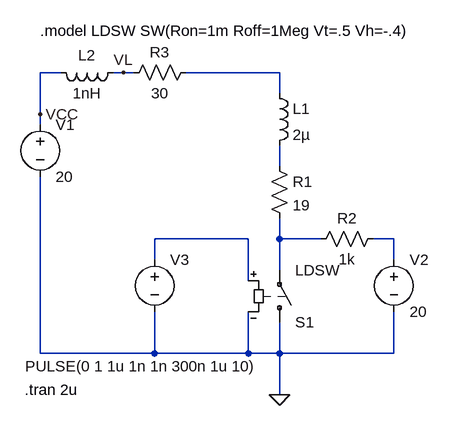
[diagram p0: schematic current_step_response_DEC.asc]
current_step_response_DEC.asc, the LTspice schematic file:
Version 4
SHEET 1 916 680
WIRE -176 80 -208 80
WIRE -80 80 -96 80
WIRE -64 80 -80 80
WIRE 160 80 16 80
WIRE 160 112 160 80
WIRE -208 144 -208 80
WIRE -208 160 -208 144
WIRE 160 224 160 192
WIRE 112 336 -32 336
WIRE 160 336 160 304
WIRE 224 336 160 336
WIRE 336 336 304 336
WIRE -32 368 -32 336
WIRE 336 368 336 336
WIRE 160 384 160 336
WIRE 112 400 112 336
WIRE -208 512 -208 240
WIRE -32 512 -32 448
WIRE -32 512 -208 512
WIRE 112 512 112 448
WIRE 112 512 -32 512
WIRE 160 512 160 464
WIRE 160 512 112 512
WIRE 336 512 336 448
WIRE 336 512 160 512
WIRE 160 576 160 512
FLAG 160 576 0
FLAG -208 144 VCC
FLAG -80 80 VL
SYMBOL ind 144 96 R0
SYMATTR InstName L1
SYMATTR Value 2µ
SYMBOL res 144 208 R0
SYMATTR InstName R1
SYMATTR Value 19
SYMBOL voltage -208 144 R0
SYMATTR InstName V1
SYMATTR Value 20
SYMBOL voltage 336 352 R0
SYMATTR InstName V2
SYMATTR Value 20
SYMBOL res 320 320 R90
WINDOW 0 0 56 VBottom 2
WINDOW 3 32 56 VTop 2
SYMATTR InstName R2
SYMATTR Value 1k
SYMBOL sw 160 480 M180
SYMATTR InstName S1
SYMATTR Value LDSW
SYMBOL voltage -32 352 R0
WINDOW 3 -199 180 Left 2
WINDOW 123 0 0 Left 0
WINDOW 39 0 0 Left 0
SYMATTR Value PULSE(0 1 1u 1n 1n 300n 1u 10)
SYMATTR InstName V3
SYMBOL res 32 64 R90
WINDOW 0 0 56 VBottom 2
WINDOW 3 32 56 VTop 2
SYMATTR InstName R3
SYMATTR Value 30
SYMBOL ind -80 64 R90
WINDOW 0 5 56 VBottom 2
WINDOW 3 32 56 VTop 2
SYMATTR InstName L2
SYMATTR Value 1nH
TEXT -208 16 Left 2 !.model LDSW SW(Ron=1m Roff=1Meg Vt=.5 Vh=-.4)
TEXT -232 568 Left 2 !.tran 2u

The netlist it stands for:
* current_step_response_DEC.asc
L1 N001 N002 2µ
R1 N002 N004 19
V1 VCC 0 20
V2 N005 0 20
R2 N005 N004 1k
S1 0 N004 N003 0 LDSW
V3 N003 0 PULSE(0 1 1u 1n 1n 300n 1u 10)
R3 N001 VL 30
L2 VL VCC 1nH
.model LDSW SW(Ron=1m Roff=1Meg Vt=.5 Vh=-.4)
.tran 2u
.backanno
.end